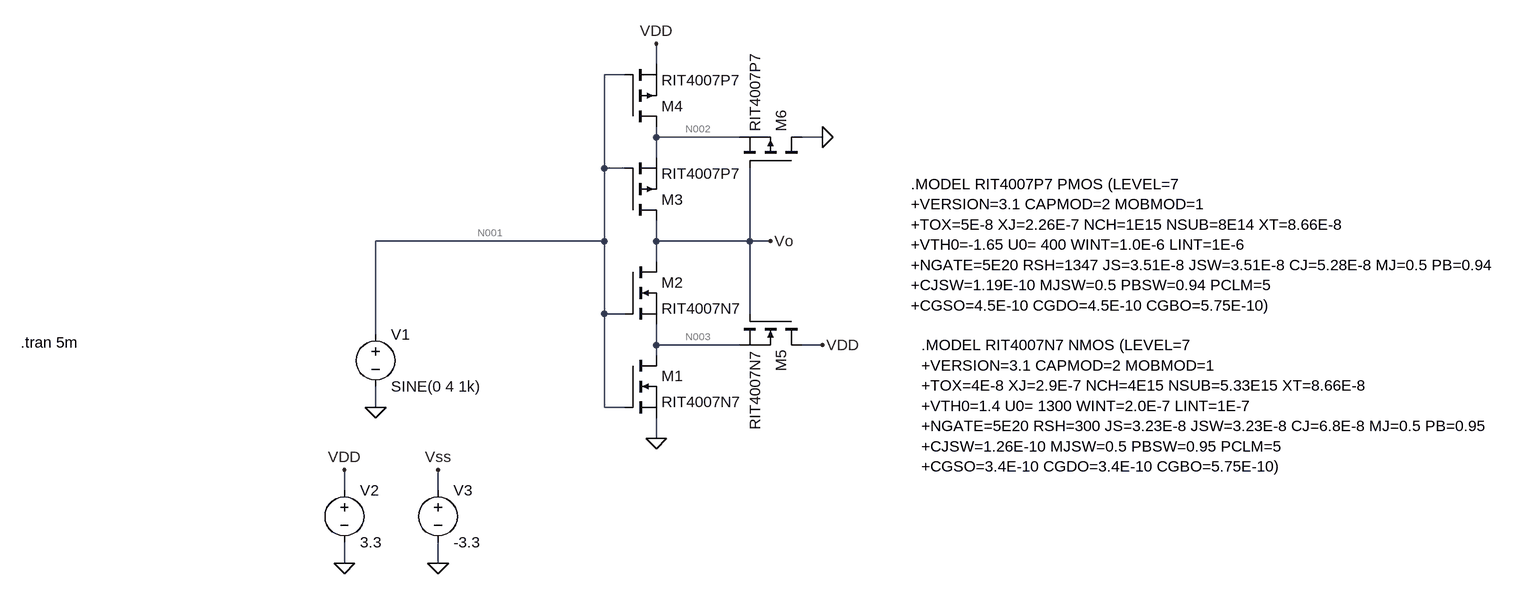
[diagram p0: schematic SchmittTriggerMOS.asc]
SchmittTriggerMOS.asc, the LTspice schematic file:
Version 4
SHEET 1 1392 1376
WIRE 96 64 96 32
WIRE 48 80 16 80
WIRE 96 176 96 160
WIRE 224 176 96 176
WIRE 352 176 320 176
WIRE 96 208 96 176
WIRE 16 224 16 80
WIRE 48 224 16 224
WIRE 16 336 16 224
WIRE 16 336 -336 336
WIRE 96 336 96 304
WIRE 240 336 240 224
WIRE 240 336 96 336
WIRE 272 336 240 336
WIRE 96 368 96 336
WIRE 16 448 16 336
WIRE 48 448 16 448
WIRE 240 448 240 336
WIRE -336 480 -336 336
WIRE 96 496 96 464
WIRE 224 496 96 496
WIRE 352 496 320 496
WIRE 96 512 96 496
WIRE -336 592 -336 560
WIRE 16 592 16 448
WIRE 48 592 16 592
WIRE 96 640 96 608
WIRE -384 720 -384 688
WIRE -240 720 -240 688
WIRE -384 832 -384 800
WIRE -240 832 -240 800
FLAG -336 592 0
FLAG -384 688 VDD
FLAG -384 832 0
FLAG -240 832 0
FLAG -240 688 Vss
FLAG 272 336 Vo
FLAG 352 496 VDD
FLAG 96 32 VDD
FLAG 96 640 0
FLAG 352 176 0
SYMBOL voltage -336 464 R0
WINDOW 123 0 0 Left 2
WINDOW 39 0 0 Left 2
SYMATTR InstName V1
SYMATTR Value SINE(0 4 1k)
SYMBOL voltage -384 704 R0
WINDOW 123 0 0 Left 2
WINDOW 39 0 0 Left 2
SYMATTR InstName V2
SYMATTR Value 3.3
SYMBOL voltage -240 704 R0
SYMATTR InstName V3
SYMATTR Value -3.3
SYMBOL nmos 48 512 R0
SYMATTR InstName M1
SYMATTR Value RIT4007N7
SYMBOL nmos 48 368 R0
SYMATTR InstName M2
SYMATTR Value RIT4007N7
SYMBOL pmos 48 304 M180
SYMATTR InstName M3
SYMATTR Value RIT4007P7
SYMBOL pmos 48 160 M180
SYMATTR InstName M4
SYMATTR Value RIT4007P7
SYMBOL nmos 320 448 R90
SYMATTR InstName M5
SYMATTR Value RIT4007N7
SYMBOL pmos 320 224 M270
SYMATTR InstName M6
SYMATTR Value RIT4007P7
TEXT -882 492 Left 2 !.tran 5m
TEXT 488 248 Left 2 !.MODEL RIT4007P7 PMOS (LEVEL=7\n+VERSION=3.1 CAPMOD=2 MOBMOD=1\n+TOX=5E-8 XJ=2.26E-7 NCH=1E15 NSUB=8E14 XT=8.66E-8\n+VTH0=-1.65 U0= 400 WINT=1.0E-6 LINT=1E-6\n+NGATE=5E20 RSH=1347 JS=3.51E-8 JSW=3.51E-8 CJ=5.28E-8 MJ=0.5 PB=0.94\n+CJSW=1.19E-10 MJSW=0.5 PBSW=0.94 PCLM=5\n+CGSO=4.5E-10 CGDO=4.5E-10 CGBO=5.75E-10)
TEXT 504 496 Left 2 !.MODEL RIT4007N7 NMOS (LEVEL=7\n+VERSION=3.1 CAPMOD=2 MOBMOD=1\n+TOX=4E-8 XJ=2.9E-7 NCH=4E15 NSUB=5.33E15 XT=8.66E-8\n+VTH0=1.4 U0= 1300 WINT=2.0E-7 LINT=1E-7\n+NGATE=5E20 RSH=300 JS=3.23E-8 JSW=3.23E-8 CJ=6.8E-8 MJ=0.5 PB=0.95\n+CJSW=1.26E-10 MJSW=0.5 PBSW=0.95 PCLM=5\n+CGSO=3.4E-10 CGDO=3.4E-10 CGBO=5.75E-10)

The netlist it stands for:
* SchmittTriggerMOS.asc
V1 N001 0 SINE(0 4 1k)
V2 VDD 0 3.3
V3 Vss 0 -3.3
M1 N003 N001 0 0 RIT4007N7
M2 Vo N001 N003 N003 RIT4007N7
M3 Vo N001 N002 N002 RIT4007P7
M4 N002 N001 VDD VDD RIT4007P7
M5 VDD Vo N003 N003 RIT4007N7
M6 0 Vo N002 N002 RIT4007P7
.model NMOS NMOS
.model PMOS PMOS
.lib standard.mos
.tran 5m
.MODEL RIT4007P7 PMOS (LEVEL=7
+VERSION=3.1 CAPMOD=2 MOBMOD=1
+TOX=5E-8 XJ=2.26E-7 NCH=1E15 NSUB=8E14 XT=8.66E-8
+VTH0=-1.65 U0= 400 WINT=1.0E-6 LINT=1E-6
+NGATE=5E20 RSH=1347 JS=3.51E-8 JSW=3.51E-8 CJ=5.28E-8 MJ=0.5 PB=0.94
+CJSW=1.19E-10 MJSW=0.5 PBSW=0.94 PCLM=5
+CGSO=4.5E-10 CGDO=4.5E-10 CGBO=5.75E-10)
.MODEL RIT4007N7 NMOS (LEVEL=7
+VERSION=3.1 CAPMOD=2 MOBMOD=1
+TOX=4E-8 XJ=2.9E-7 NCH=4E15 NSUB=5.33E15 XT=8.66E-8
+VTH0=1.4 U0= 1300 WINT=2.0E-7 LINT=1E-7
+NGATE=5E20 RSH=300 JS=3.23E-8 JSW=3.23E-8 CJ=6.8E-8 MJ=0.5 PB=0.95
+CJSW=1.26E-10 MJSW=0.5 PBSW=0.95 PCLM=5
+CGSO=3.4E-10 CGDO=3.4E-10 CGBO=5.75E-10)
.backanno
.end

* Results of the author's LTspice run, read from the files saved beside the schematic
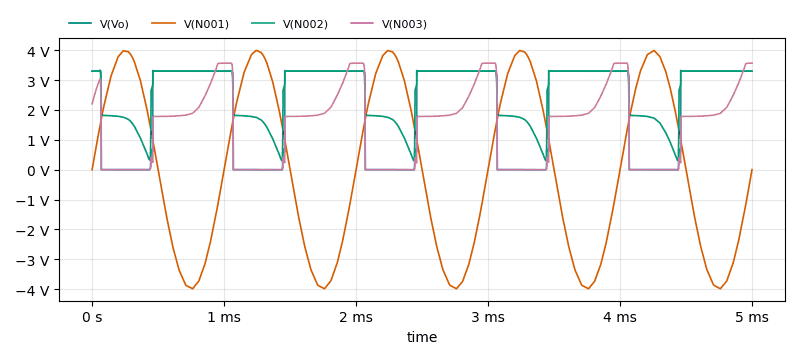
[diagram p1: Transient Analysis of SchmittTriggerMOS.asc, plotted from the saved traces]
* Transient Analysis, 1 run:
*   V(Vo): min -10.76 mV, max 3.325 V, average 2.017 V, rms 2.573 V, last 3.3 V
*   V(N001): min -3.991 V, max 3.997 V, average 2.129 mV, rms 2.819 V, last 0 V
*   V(N002): min 298.7 mV, max 3.324 V, average 2.597 V, rms 2.759 V, last 3.3 V
*   V(N003): min -15.82 mV, max 3.569 V, average 1.436 V, rms 1.914 V, last 3.568 V